# Altium schematic sheet Power.SchDoc
size A4; DocumentNumber: 1; SheetNumber: 1; SheetTotal: 4
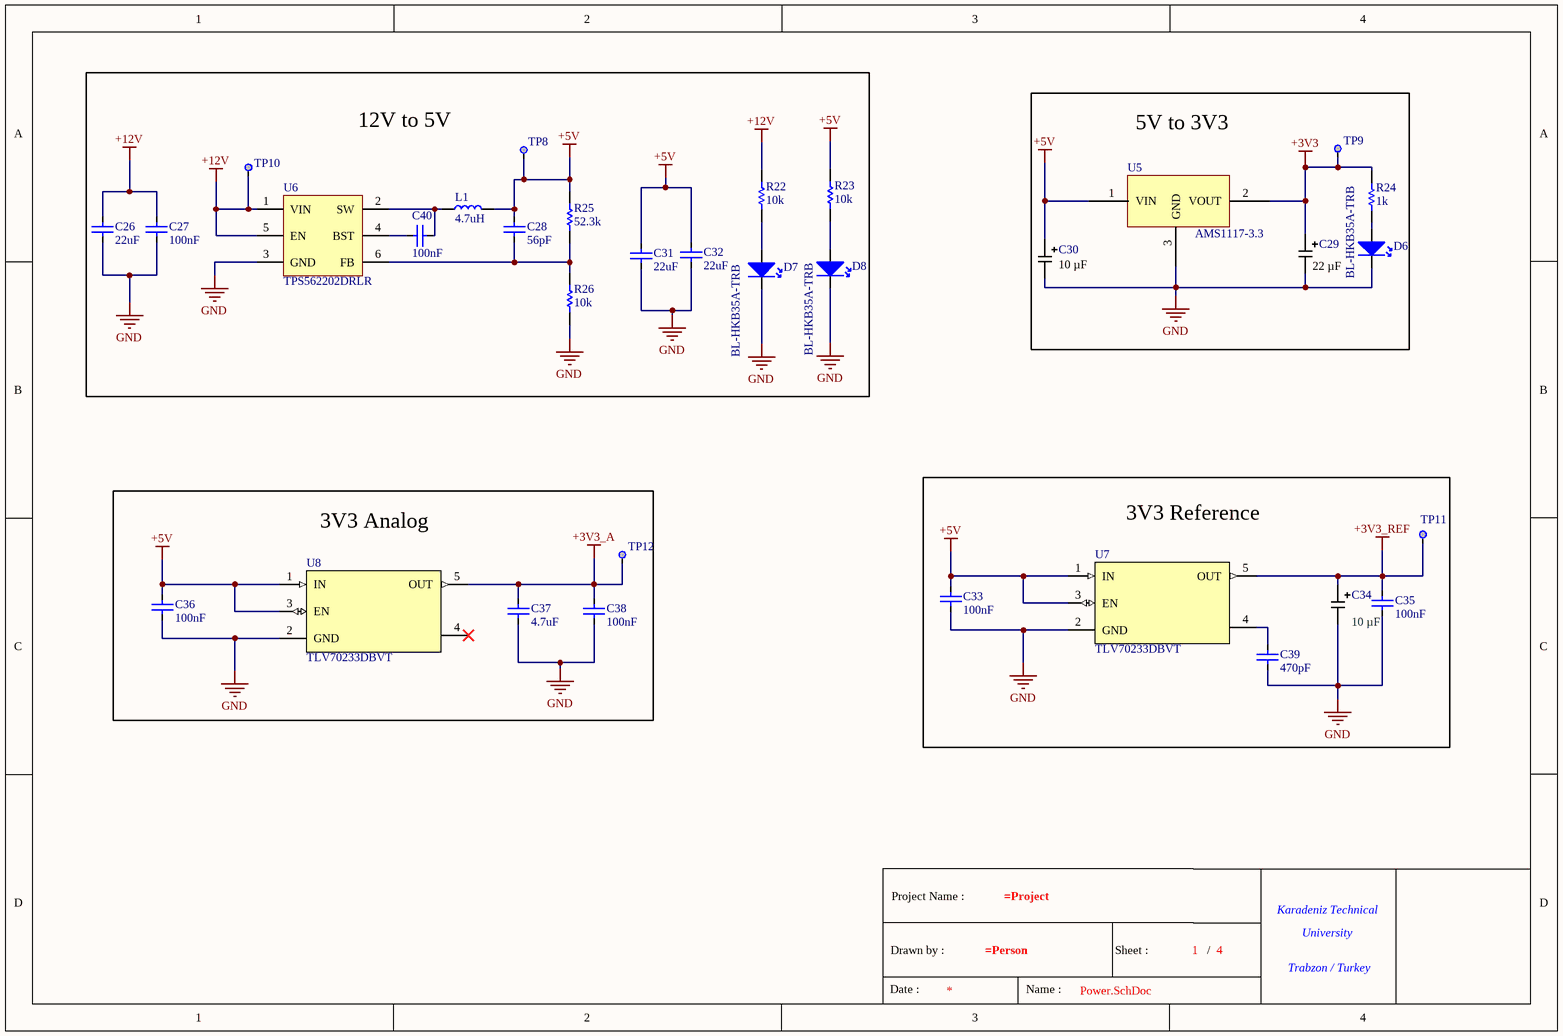
[diagram p0: Power.SchDoc]

## Parts
*  Title Block  (value not drawn)  (graphical)
C26  22uF  [CAP-1210]
C27  100nF  [CAP-0603]
C28  56pF  [CAP-0603]
C29  Capacitance: 22 µF  [KEMET_CAP_TAN-B]  (hidden comment: T491B226K020AT)
C30  Capacitance: 10 µF  [KEMET_CAP_TAN-B]  (hidden comment: T491B106M016AT)
C31  22uF  [CAP-1210]
C32  22uF  [CAP-1210]
C33  100nF  [CAP-0603]
C34  Capacitance: 10 µF  [KEMET_CAP_TAN-B]  (hidden comment: T491B106M016AT)
C35  100nF  [CAP-0603]
C36  100nF  [CAP-0603]
C37  4.7uF  [CAP-0805]
C38  100nF  [CAP-0603]
C39  470pF  [CAP-0603]
C40  100nF  [CAP-0603]
D6  BL-HKB35A-TRB  [LED-0805]
D7  BL-HKB35A-TRB  [LED-0805]
D8  BL-HKB35A-TRB  [LED-0805]
L1  4.7uH  [IND_EATON_DR125-4R7-R]
R22  10k  [RES-0603]
R23  10k  [RES-0603]
R24  1k  [RES-0603]
R25  52.3k  [RES-0603]
R26  10k  [RES-0603]
TP8  Test Point  [0.8mm Test Point]  (value not drawn)  (no BOM)
TP9  Test Point  [0.8mm Test Point]  (value not drawn)  (no BOM)
TP10  Test Point  [0.8mm Test Point]  (value not drawn)  (no BOM)
TP11  Test Point  [0.8mm Test Point]  (value not drawn)  (no BOM)
TP12  Test Point  [0.8mm Test Point]  (value not drawn)  (no BOM)
U5  AMS1117-3.3  [SOT-223]
U6  TPS562202DRLR  [SOT-563]
U7  TLV70233DBVT  [SOT23-5]
U8  TLV70233DBVT  [SOT23-5]

## Blocks framed on the sheet
12V to 5V: C26-C28 C31 C32 C40 D7 D8 L1 R22 R23 R25 R26 TP8 TP10 U6
5V to 3V3: C29 C30 D6 R24 TP9 U5
3V3 Analog: C36-C38 TP12 U8
3V3 Reference: C33-C35 C39 TP11 U7

## Nets
+3V3: C29.1 R24.1 TP9.1 U5.2(VOUT)
+3V3_A: C37.2 C38.2 TP12.1 U8.5(OUT)
+3V3_REF: C34.1 C35.2 TP11.1 U7.5(OUT)
+5V: C28.2 C30.1 C31.2 C32.2 C33.2 C36.2 L1.2 R23.2 R25.2 TP8.1 U5.1(VIN) U7.1(IN) U7.3(EN) U8.1(IN) U8.3(EN)
+12V: C26.2 C27.2 R22.2 TP10.1 U6.1(VIN) U6.5(EN)
GND: C26.1 C27.1 C29.2 C30.2 C31.1 C32.1 C33.1 C34.2 C35.1 C36.1 C37.1 C38.1 C39.1 D6.2(K) D7.2(K) D8.2(K) R26.1 U5.3(GND) U6.3(GND) U7.2(GND) U8.2(GND)
NetC28_1: C28.1 R25.1 R26.2 U6.6(FB)
NetC39_2: C39.2 U7.4
NetC40_1: C40.1 L1.1 U6.2(SW)
NetC40_2: C40.2 U6.4(BST)
NetD6_1: D6.1(A) R24.2
NetD7_1: D7.1(A) R22.1
NetD8_1: D8.1(A) R23.1

Not connected (* = marked no-connect by the designer): U8 4*

## Notes on the sheet
- (in symbol Title Block) Project Name :; Karadeniz Technical; University; Drawn by :; Sheet :; /; Trabzon / Turkey; Date :; Name :

## Library data of the parts
* = Title Block: Standart Title Block
C26 C31 C32 = CL32B226KAJNNNE: Manufacturer: Samsung Electro-Mechanics; Temperature Coefficient: X7R; Voltage: 25V; Library Reference: Capacitor; Tolerance: %10; Man Code: CL32B226KAJNNNE; Value: 22uF; Footprint: 1210; Component Type: Ceramic Capacitor
C27 C33 C35 C36 C38 C40 = CGA3E2X7R1H104K080AA: Manufacturer: TDK; Temperature Coefficient: X7R; Voltage: 50V; Library Reference: Capacitor; Tolerance: %10; Man Code: CGA3E2X7R1H104K080AA; Value: 100nF; Footprint: 0603; Component Type: Ceramic Capacitor
C28 = GCM1885C2A560FA16D: Manufacturer: Murata; Library Reference: Capacitor; Tolerance: %1; Temperature Coefficient: C0G; Voltage: 100V; Man Code: GCM1885C2A560FA16D; Value: 56pF; Footprint: 0603; Component Type: Ceramic Capacitor
C29 = T491B226K020AT: CAP TANT 22UF 10% 20V 1411; Manufacturer: KEMET; Manufacturer Size Code: B; Type: Molded; ESR (Equivalent Series Resistance): 4 Ohm; Lifetime @ Temp.: 2000 Hrs @ 125°C; Series: T491; Package: Tape & Reel (TR); Tolerance: ±10%; Operating Temperature: -55°C ~ 125°C; Mounting Type: Surface Mount; Package / Case: 1411 (3528 Metric); Size / Dimension: 0.138" L x 0.110" W (3.50mm x 2.80mm); Height - Seated (Max): 0.083" (2.10mm); Lead Spacing: -; Ratings: -; Features: General Purpose; Failure Rate: -; Voltage - Rated: 20 V; Ozdisan Link: https://ozdisan.com/pasif-komponentler/kondansatorler/tantal-kondansatorler/T491B226K020AT; Digikey Link: https://www.digikey.com/en/products/detail/kemet/T491B226K020AT/1842086; Farnell TR Link: https://tr.farnell.com/kemet/t491b226k020at/cap-22-f-20v-10/dp/2321214?st=t491b226k020at; Mouser Link: https://www.mouser.com.tr/ProductDetail/KEMET/T491B226K020AT?qs=2QcrrtqkWlnFmgDgM5wdlA%3D%3D
C30 C34 = T491B106M016AT: CAP TANT 10UF 20% 16V 1411; Manufacturer: KEMET; Manufacturer Size Code: B; Type: Molded; ESR (Equivalent Series Resistance): 2.5 Ohm; Lifetime @ Temp.: 2000 Hrs @ 125°C; Series: T491; Package: Tape & Reel (TR); Tolerance: ±20%; Operating Temperature: -55°C ~ 125°C; Mounting Type: Surface Mount; Package / Case: 1411 (3528 Metric); Size / Dimension: 0.138" L x 0.110" W (3.50mm x 2.80mm); Height - Seated (Max): 0.083" (2.10mm); Lead Spacing: -; Ratings: -; Features: General Purpose; Failure Rate: -; Voltage - Rated: 16 V; Ozdisan Link: https://ozdisan.com/pasif-komponentler/kondansatorler/tantal-kondansatorler/T491B106M016AT; Digikey Link: https://www.digikey.com/en/products/detail/kemet/T495B475M025ZTE750/8764094; Farnell TR Link: https://tr.farnell.com/kemet/t491b106m016at/cap-10-f-16v-20/dp/2462772?st=t491b106m016at; Mouser Link: https://www.mouser.com.tr/ProductDetail/KEMET/T491B106M016AT?qs=WydH9nGI6cAnkEyQJLjSzA%3D%3D
C37 = C0805C475K3RACAUTO: Manufacturer: Kemet; Temperature Coefficient: X7R; Voltage: 25V; Library Reference: Capacitor; Tolerance: %10; Man Code: C0805C475K3RACAUTO; Value: 4.7uF; Footprint: 0805; Component Type: Ceramic Capacitor
C39 = CL10B471KB8NNNC: Manufacturer: Samsung; Voltage: 50V; Tolerance: %10; Component Type: Capacitor; Footprint: 0603; Man Code: CL10B471KB8NNNC; Value: 470pF
D6-D8 = BL-HKB35A-TRB: Manufacturer: BRIGHT LED; Colour: Yellow; Vf: 2.2V; Library Reference: Miscellaneous; Luminous Intensity: 94mcd; If: 20mA; Lens Transparency: Water Clear; Man Code: BL-HKB35A-TRB; Footprint: 0805; Component Type: Led
L1 = DR125-4R7-R: Manufacturer: Eaton; Max Dc Resistance: 10.5mOhm; Tolerance: %20; Max DC Current: 7.18A; Library Reference: Inductor; Man Code: DR125-4R7-R; Value: 4.7uH; Footprint: Surface Mount (12.5mm* 12.5mm); Component Type: Fixed Inductor
R22 R23 R26 = CRCW060310K0FKEA: Manufacturer: Vishay; Tolerance: %1; Power: 0.1W; Library Reference: Resistor; Man Code: CRCW060310K0FKEA; Value: 10k; Footprint: 0603; Component Type: Chip Resistor
R24 = CRCW06031K00FKEAC: Manufacturer: Vishay; Library Reference: Resistor; Tolerance: %1; Power: 0.1W; Man Code: CRCW06031K00FKEAC; Footprint: 0603; Component Type: Chip Resistor; Value: 1k
R25 = ERJ-3EKF5232V: Manufacturer: Panasonic; Tolerance: %1; Power: 0.1W; Library Reference: Resistor; Man Code: ERJ-3EKF5232V; Value: 52.3k; Footprint: 0603; Component Type: Chip Resistor
TP8-TP12 = Test Point: Library Reference: Miscellaneous; Component Type: Test Point
U5 = AMS1117-3.3: Manufacturer: Monolithic; Componenet Type: Regulator; Output Voltage: 3.3V; Output Current: 1A; Man Code: AMS1117-3.3
U6 = TPS562202DRLR: Manufacturer: Texas Instruments; Library Reference: Integrated_Circuit; Man Code: TPS562202DRLR; Component Type: Switcher
U7 U8 = TLV70233DBVT: Manufacturer: TEXAS; Current: 300mA; Voltage: 3.3V; Component Type: LDO; Man Code: TLV70233DBVT